# Altium schematic sheet PSU.SchDoc
size A4; SheetNumber: 3; SheetTotal: 7
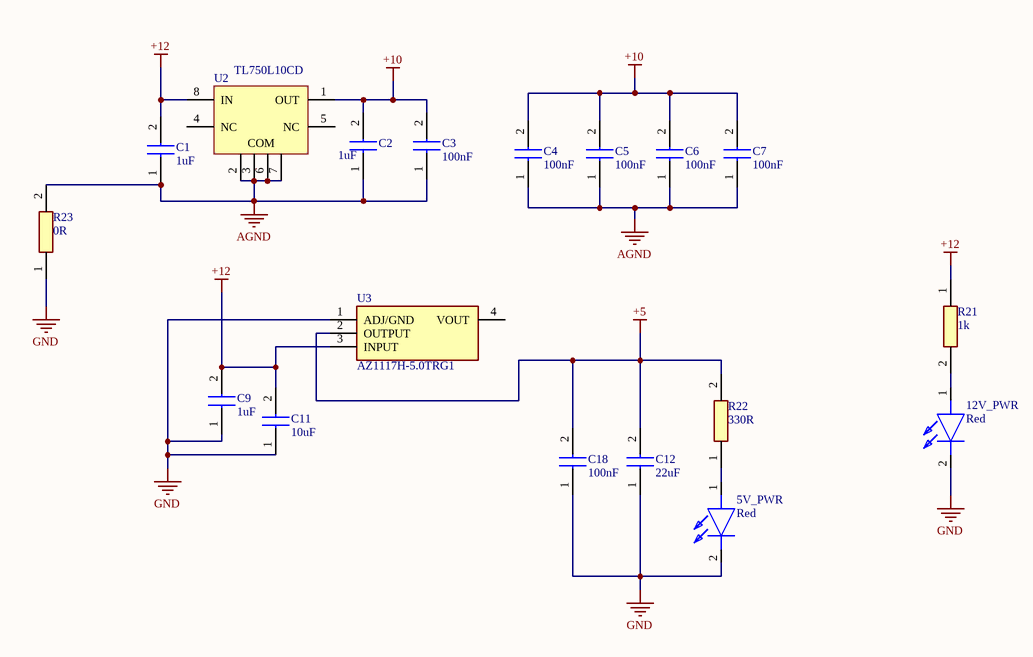
[diagram p0: PSU.SchDoc]

## Parts
5V_PWR  Red  [APT2012SECKJ3PRV]
12V_PWR  Red  [APT2012SECKJ3PRV]
C1  1uF  [CAPC1005X55N]
C2  1uF  [CAPC1005X55N]
C3  100nF  [CAPC1005X55N]
C4  100nF  [CAPC1005X55N]
C5  100nF  [CAPC1005X55N]
C6  100nF  [CAPC1005X55N]
C7  100nF  [CAPC1005X55N]
C9  1uF  [CAPC1005X55N]
C11  10uF  [C1608_Commercial]
C12  22uF  [C3216_Commercial]
C18  100nF  [CAPC1005X55N]
R21  1k  [ERA2V_(0402)]
R22  330R  [ERJ2RKD1004X]
R23  0R  [RESC1005X40N]
U2  TL750L10CD  [D0008A_M]
U3  AZ1117H-5.0TRG1  [SOT230P700X180-4N]

## Nets
+5: C12.2 C18.2 R22.2 U3.2(OUTPUT)
+10: C2.2 C3.2 C4.2 C5.2 C6.2 C7.2 U2.1(OUT)
+12: C1.2 C9.2 C11.2 R21.1 U2.8(IN) U3.3(INPUT)
AGND: C1.1 C2.1 C3.1 C4.1 C5.1 C6.1 C7.1 R23.2 U2.2(COM) U2.3(COM) U2.6(COM) U2.7(COM)
GND: 5V_PWR.2(K) 12V_PWR.2(K) C9.1 C11.1 C12.1 C18.1 R23.1 U3.1(ADJ/GND)
Net5V_PWR_1: 5V_PWR.1(A) R22.1
Net12V_PWR_1: 12V_PWR.1(A) R21.2

Not connected (* = marked no-connect by the designer): U2 4(NC) 5(NC); U3 4(VOUT)

## Notes on the sheet
- Project:
- File:
- Size:
- A4
- Author:
- Revision:
- Date:
- Sheet
- of

## Library data of the parts
5V_PWR 12V_PWR = APT2012SECK_J3-PRV: LED; Manufacturer_Name: Kingbright; Manufacturer_Part_Number: APT2012SECK/J3-PRV; Datasheet Link: https://www.mouser.de/datasheet/2/216/APT2012SECK-J3-PRV-1173389.pdf; Height: 0.85mm
C1 C2 C9 = GRT155C81E105KE13D: Capacitor; Manufacturer_Name: Murata Electronics; Datasheet Link: https://psearch.en.murata.com/capacitor/product/GRT155C81E105KE13%23.html; Height: 0.55mm; Manufacturer_Part_Number: GRT155C81E105KE13D
C3-C7 C18 = GCM155L81E104KE02D: Capacitor; Manufacturer_Name: Murata Electronics; Datasheet Link: https://psearch.en.murata.com/capacitor/product/GCM155L81E104KE02%23.html; Height: 0.55mm; Manufacturer_Part_Number: GCM155L81E104KE02D
C11 = C1608JB1E106M080AC: Capacitor; Manufacturer_Name: TDK; Datasheet Link: https://product.tdk.com/system/files/dam/doc/product/capacitor/ceramic/mlcc/catalog/mlcc_commercial_general_en.pdf; Height: 0.9mm; Manufacturer_Part_Number: C1608JB1E106M080AC
C12 = C3216X6S1E226M160AC: Capacitor; Manufacturer_Name: TDK; Datasheet Link: https://product.tdk.com/system/files/dam/doc/product/capacitor/ceramic/mlcc/catalog/mlcc_commercial_general_en.pdf; Height: 0.75mm; Manufacturer_Part_Number: C3216X6S1E226M160AC
R21 = ERA-2VEB1001X: Resistor; Manufacturer_Name: Panasonic; Datasheet Link: http://industrial.panasonic.com/cdbs/www-data/pdf/RDM0000/RDM0000C331.pdf; Height: 0.4mm; Manufacturer_Part_Number: ERA-2VEB1001X
R22 = ERJ-2RHD3300X: Resistor; Manufacturer_Name: Panasonic; Datasheet Link: https://datasheet.datasheetarchive.com/originals/distributors/DKDS41/DSANUWW0038499.pdf; Height: 0.4mm; Manufacturer_Part_Number: ERJ-2RHD3300X
R23 = RC0402JR-130RL: Resistor; Manufacturer_Name: YAGEO (PHYCOMP); Datasheet Link: https://datasheet.datasheetarchive.com/originals/distributors/Datasheets_SAMA/902f9e387b938f871d31120f5fc1d65e.pdf; Height: 0.4mm; Manufacturer_Part_Number: RC0402JR-130RL
U2 = CMP-0394-00106-2: Single Output LDO, 150 mA, Fixed 10 V Output, 11 to 26 V Input, with Low IQ, 8-pin SOIC (D), 0 to 125 degC, Green (RoHS & no Sb/Br); Manufacturer: Texas Instruments; Fixed Output Options(V): 10; Accuracy(%): 4; Vdo(Typ)(mV): 600; Rating: Catalog; Iq(Typ)(mA): 1; SubFamily: Single Channel LDO; Iout(Max)(A): 0.15; Vin(Min)(V): 11; Vin(Max)(V): 26; ComponentLink1URL: http://www.ti.com/; ComponentLink3URL: http://www.ti.com/litv/pdf/msoi002j; ComponentLink4Description: URL Link1; Eco-Plan: Green (RoHS & no Sb/Br); PackageVersion: 4040047-3/M; Vout Adj(Min)(V): 10; Mounting Technology: Surface Mount; ComponentLink1Description: Manufacturer URL; PartNumber: TL750L10CD; PackageDescription: 8-Pin Plastic Small Outline, Body 4.9 x 3.9 mm, Pitch 1.27 mm; Code_JEDEC: MS-012; ComponentLink2URL: http://www.ti.com/general/docs/lit/getliterature.tsp?genericPartNumber=TL750L10&fileType=pdf; Vout Adj(Max)(V): 10; ComponentLink2Description: Datasheet; ComponentLink3Description: Package Specification; ComponentLink4URL: Samples URL:http://www.ti.com/product/tl750l10#samples; DatasheetVersion: SLVS017U; PackageReference: D0008A
U3 = AZ1117H-5.0TRG1: Integrated Circuit; Manufacturer_Name: Diodes Inc.; Datasheet Link: https://media.digikey.com/pdf/Data%20Sheets/Diodes%20PDFs/AZ1117_Rev2.1.pdf; Height: 1.8mm; Manufacturer_Part_Number: AZ1117H-5.0TRG1